# EAGLE design p128relay (EAGLE 9.6.2)
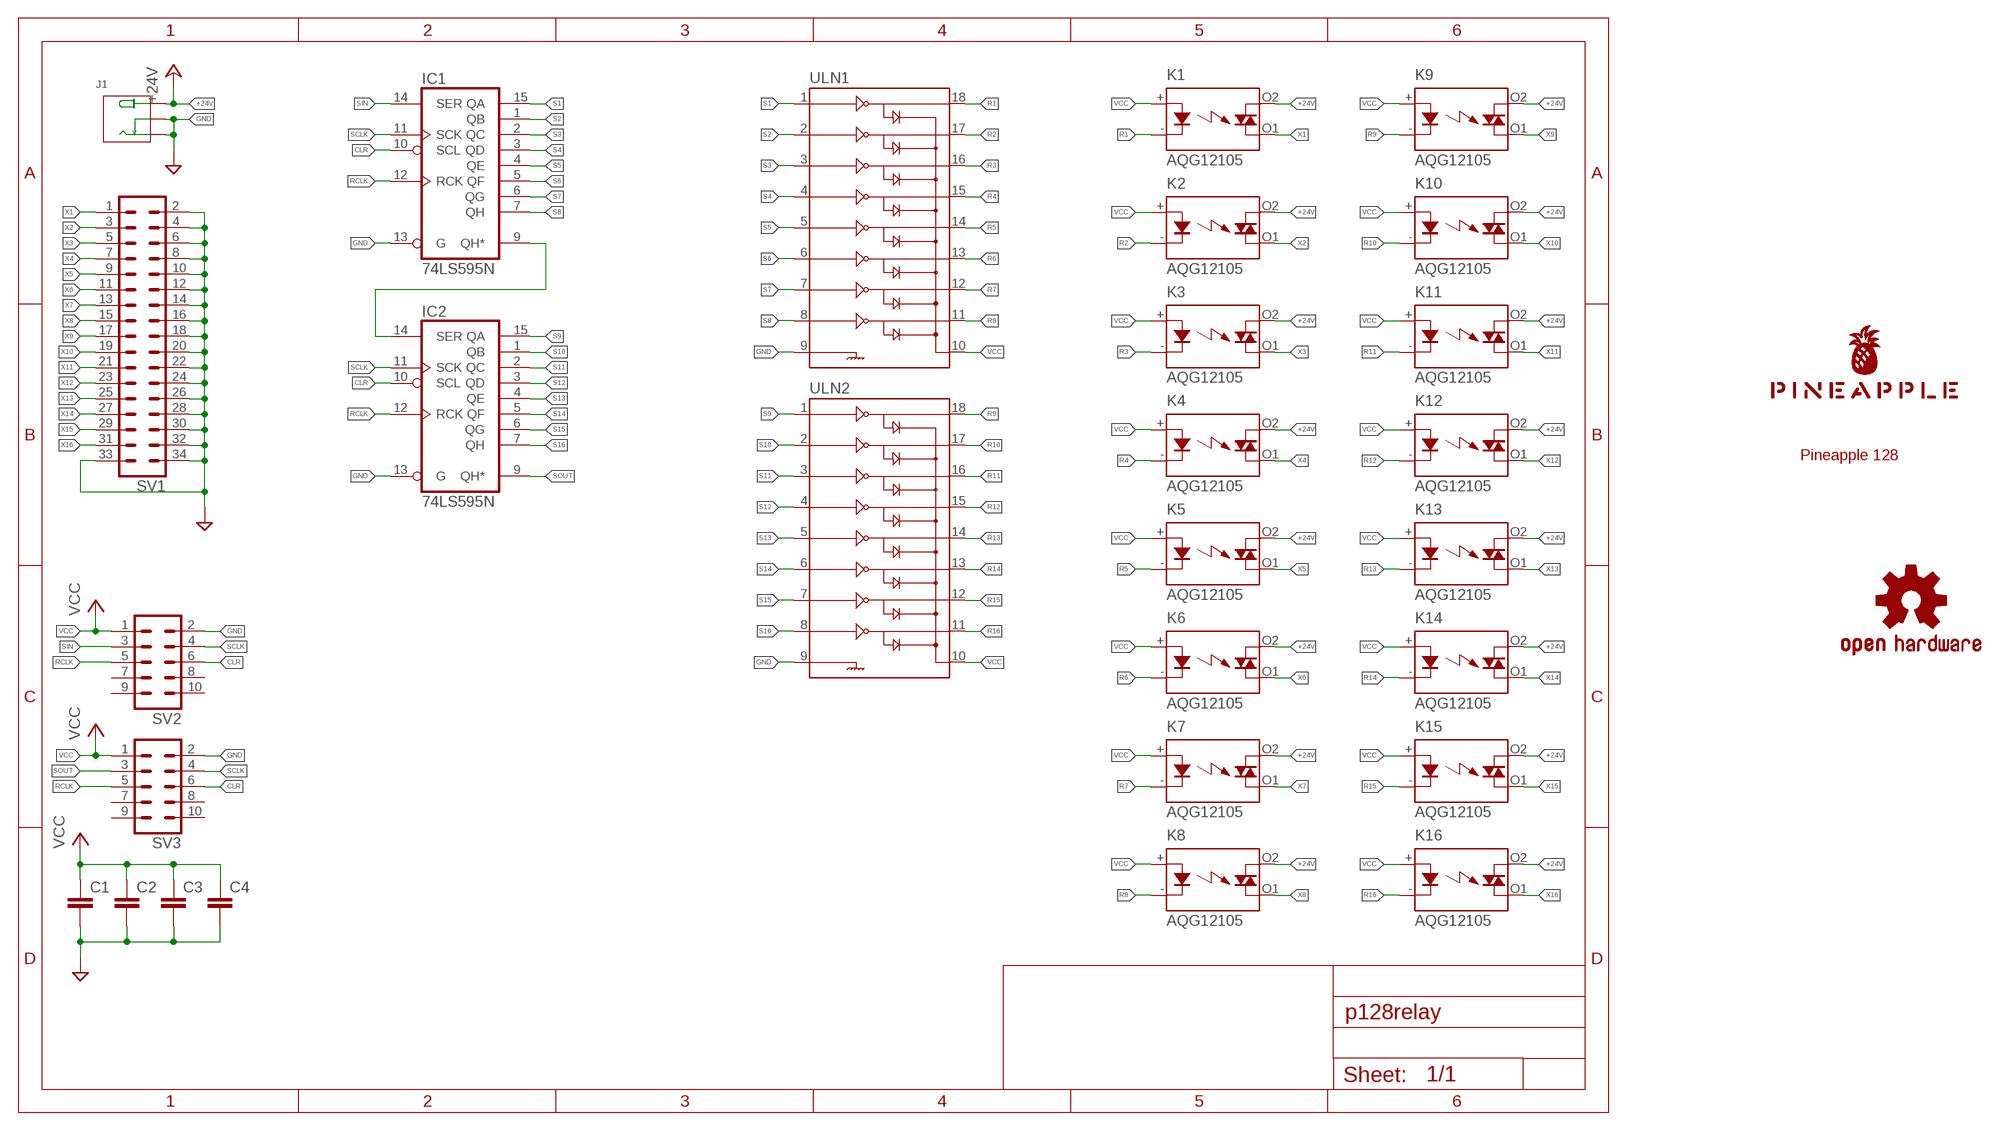
[diagram p0: schematic, sheet 1]

## Parts
C1  C-EU025-024X044  [C025-024X044]
C2  C-EU025-024X044  [C025-024X044]
C3  C-EU025-024X044  [C025-024X044]
C4  C-EU025-024X044  [C025-024X044]
IC1  74LS595N  [DIL16]
IC2  74LS595N  [DIL16]
J1  JACK-DC-005'DC-005'  [3P-L14.2*W11.0*H9.0MM]
K1  AQG12105  [AQG]
K2  AQG12105  [AQG]
K3  AQG12105  [AQG]
K4  AQG12105  [AQG]
K5  AQG12105  [AQG]
K6  AQG12105  [AQG]
K7  AQG12105  [AQG]
K8  AQG12105  [AQG]
K9  AQG12105  [AQG]
K10  AQG12105  [AQG]
K11  AQG12105  [AQG]
K12  AQG12105  [AQG]
K13  AQG12105  [AQG]
K14  AQG12105  [AQG]
K15  AQG12105  [AQG]
K16  AQG12105  [AQG]
LOGO1  OSHW-LOGOS-COPPER  [OSHW-LOGO-S_COPPER]
SV1  ML34L  [ML34L]
SV2  ML10L  [ML10L]
SV3  ML10L  [ML10L]
U$1  PINEAPPLE450_SILK  [PINEAPPLE450_SILK]
ULN1  ULN2803DIP  [DIL18]
ULN2  ULN2803DIP  [DIL18]

## Nets
+24V [power]: J1.+ K1.O2(DS1) K2.O2(DS1) K3.O2(DS1) K4.O2(DS1) K5.O2(DS1) K6.O2(DS1) K7.O2(DS1) K8.O2(DS1) K9.O2(DS1) K10.O2(DS1) K11.O2(DS1) K12.O2(DS1) K13.O2(DS1) K14.O2(DS1) K15.O2(DS1) K16.O2(DS1)
CLR: IC1.10(SCL) IC2.10(SCL) SV2.6 SV3.6
GND [gnd]: C1.2 C2.2 C3.2 C4.2 IC1.13(G) IC2.13(G) J1.-1(-) J1.-2(CDN) SV1.2 SV1.4 SV1.6 SV1.8 SV1.10 SV1.12 SV1.14 SV1.16 SV1.18 SV1.20 SV1.22 SV1.24 SV1.26 SV1.28 SV1.30 SV1.32 SV1.33 SV1.34 SV2.2 SV3.2 ULN1.9 ULN2.9
N$9: IC1.9(QH*) IC2.14(SER)
R1: K1.-(K) ULN1.18
R2: K2.-(K) ULN1.17
R3: K3.-(K) ULN1.16
R4: K4.-(K) ULN1.15
R5: K5.-(K) ULN1.14
R6: K6.-(K) ULN1.13
R7: K7.-(K) ULN1.12
R8: K8.-(K) ULN1.11
R9: K9.-(K) ULN2.18
R10: K10.-(K) ULN2.17
R11: K11.-(K) ULN2.16
R12: K12.-(K) ULN2.15
R13: K13.-(K) ULN2.14
R14: K14.-(K) ULN2.13
R15: K15.-(K) ULN2.12
R16: K16.-(K) ULN2.11
RCLK: IC1.12(RCK) IC2.12(RCK) SV2.5 SV3.5
S1: IC1.15(QA) ULN1.1
S2: IC1.1(QB) ULN1.2
S3: IC1.2(QC) ULN1.3
S4: IC1.3(QD) ULN1.4
S5: IC1.4(QE) ULN1.5
S6: IC1.5(QF) ULN1.6
S7: IC1.6(QG) ULN1.7
S8: IC1.7(QH) ULN1.8
S9: IC2.15(QA) ULN2.1
S10: IC2.1(QB) ULN2.2
S11: IC2.2(QC) ULN2.3
S12: IC2.3(QD) ULN2.4
S13: IC2.4(QE) ULN2.5
S14: IC2.5(QF) ULN2.6
S15: IC2.6(QG) ULN2.7
S16: IC2.7(QH) ULN2.8
SCLK: IC1.11(SCK) IC2.11(SCK) SV2.4 SV3.4
SIN: IC1.14(SER) SV2.3
SOUT: IC2.9(QH*) SV3.3
VCC: C1.1 C2.1 C3.1 C4.1 K1.+(A) K2.+(A) K3.+(A) K4.+(A) K5.+(A) K6.+(A) K7.+(A) K8.+(A) K9.+(A) K10.+(A) K11.+(A) K12.+(A) K13.+(A) K14.+(A) K15.+(A) K16.+(A) SV2.1 SV3.1 ULN1.10 ULN2.10
X1: K1.O1(DS2) SV1.1
X2: K2.O1(DS2) SV1.3
X3: K3.O1(DS2) SV1.5
X4: K4.O1(DS2) SV1.7
X5: K5.O1(DS2) SV1.9
X6: K6.O1(DS2) SV1.11
X7: K7.O1(DS2) SV1.13
X8: K8.O1(DS2) SV1.15
X9: K9.O1(DS2) SV1.17
X10: K10.O1(DS2) SV1.19
X11: K11.O1(DS2) SV1.21
X12: K12.O1(DS2) SV1.23
X13: K13.O1(DS2) SV1.25
X14: K14.O1(DS2) SV1.27
X15: K15.O1(DS2) SV1.29
X16: K16.O1(DS2) SV1.31
Unconnected: SV2.7 SV2.8 SV2.9 SV2.10 SV3.7 SV3.8 SV3.9 SV3.10

## Notes on the sheet
- Pineapple 128

## Power pins joined to a net without a drawn wire
GND: IC1.8(GND) IC2.8(GND)
VCC: IC1.16(VCC) IC2.16(VCC)

## Library data of the parts
C1-C4 = resistor:C-EU: CAPACITOR, European symbol
IC1 IC2 = 74xx-us:74*595: 8-bit SHIFT REGISTER, output latch
J1 = Seeed-Connector:JACK-DC-005: 320120003
K1-K16 = relay:AQG*: SOLID STATE RELAY NAiS Zero-cross, Non zero-cross Source: http://www.mew-europe.com/.. en_ds_61611_0000.pdf; MF: AROMAT/ MATSUSHITA; MPN: AQG12105; OC_FARNELL: unknown; OC_NEWARK: 20J4759
LOGO1 = SparkFun-Aesthetics:OSHW-LOGO: Open-Source Hardware (OSHW) Logo This logo indicates the piece of hardware it is found on incorporates a OSHW license and/or adheres to the definition of open source hardware found here: http://freedomdefined.org/OSHW
SV1 = con-ml:ML34L: HARTING; OC_FARNELL: unknown; OC_NEWARK: unknown
SV2 SV3 = con-ml:ML10L: HARTING; OC_FARNELL: unknown; OC_NEWARK: unknown
U$1 = pineapple:PINEAPPLE450_SILK
ULN1 ULN2 = SparkFun-IC-Special-Function:ULN2803: Darlington Driver(IC-07959, low stock) ULN2803 Darlington array. 500mA max per channel, 8-channel package. Spark Fun Electronics SKU : COM-00312

## Net classes
0 default: width 0.152 mm, drill 0.152 mm, clearance 0.152 mm
1 gnd: width 0.61 mm, drill 0.152 mm, clearance 0.152 mm
2 power: width 0.61 mm, drill 0.152 mm, clearance 0.152 mm
3 analog: width 0.305 mm, drill 0.152 mm, clearance 0.152 mm

## Board
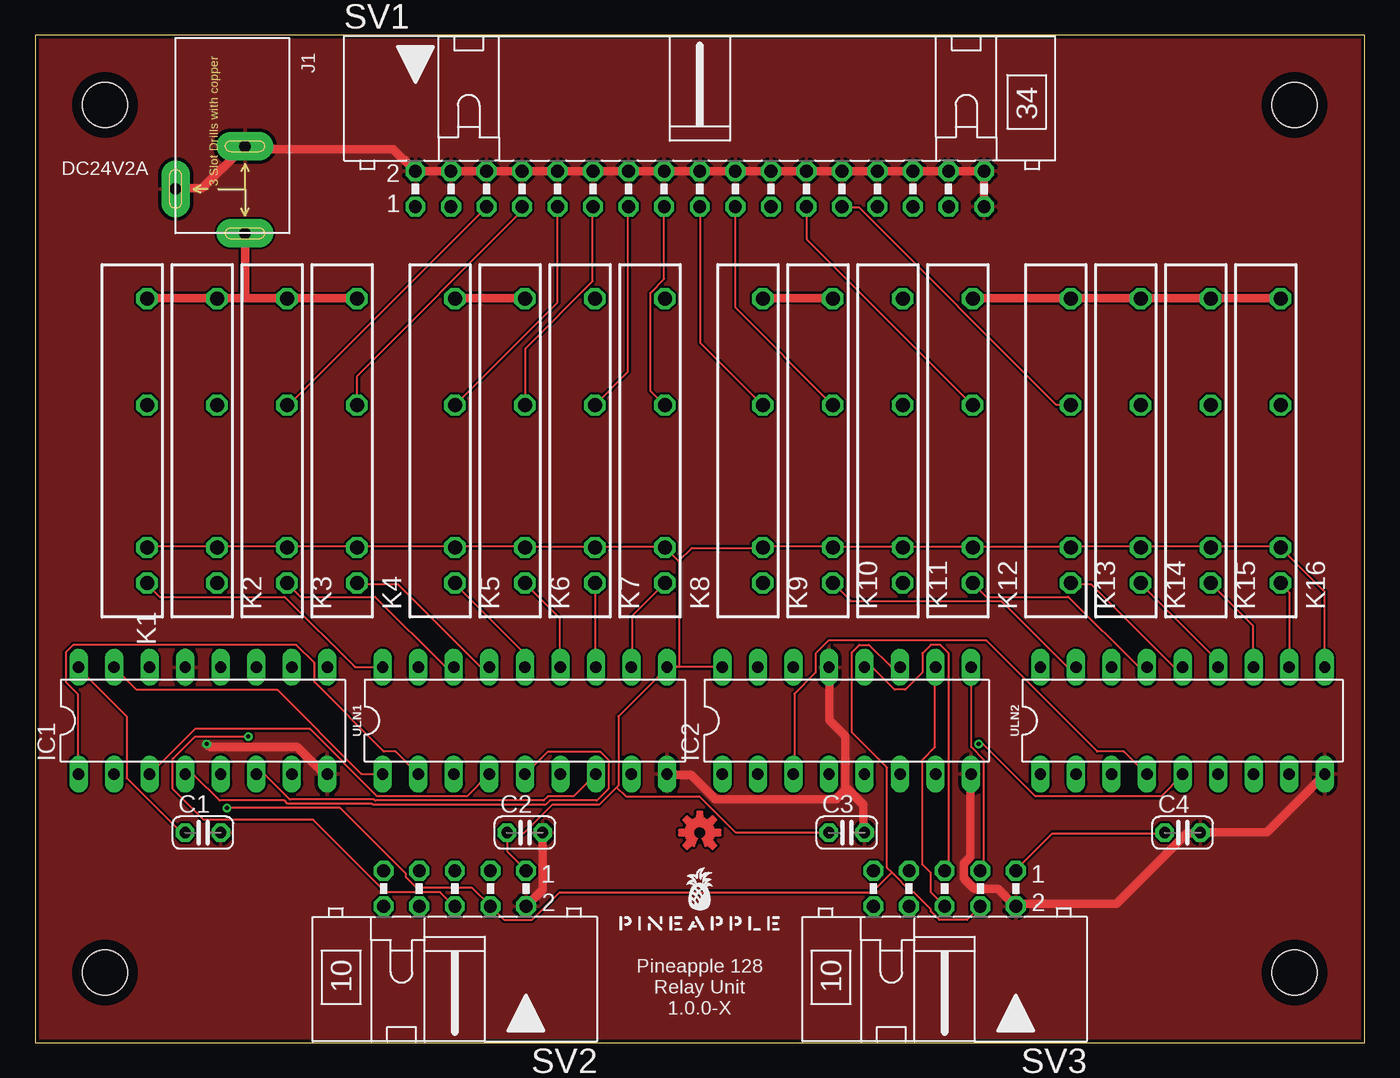
[diagram p1: board, top side]
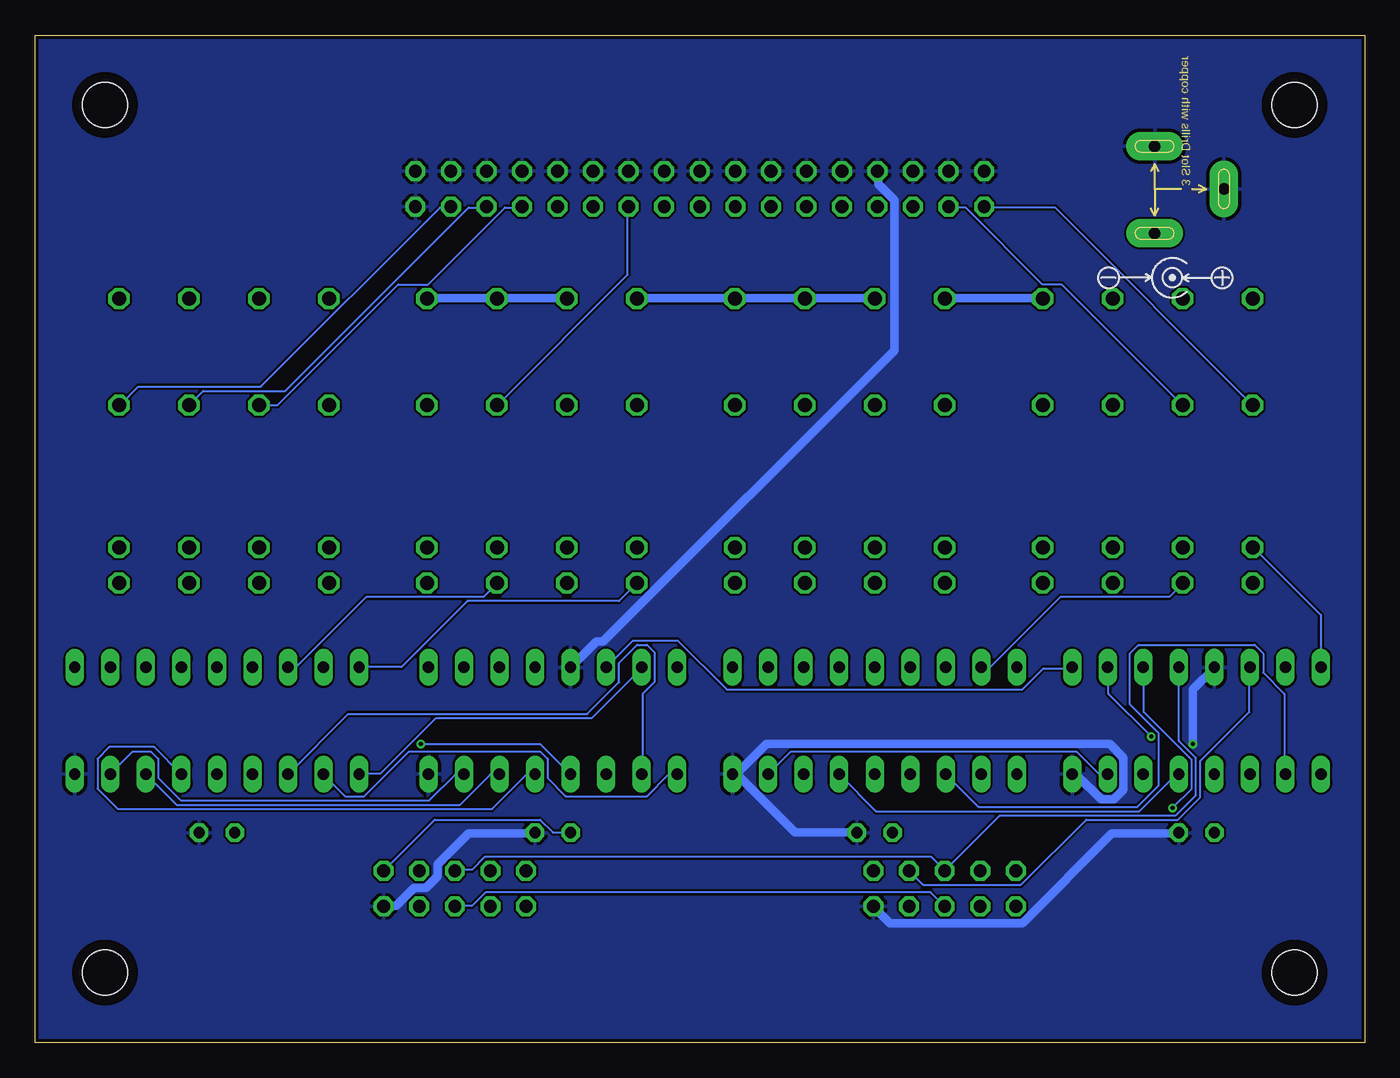
[diagram p2: board, bottom side, seen from below]

Size 95 x 72 mm. Coordinates in mm from the lower left corner, seen from the top.
Outline: 0,0 95,0 95,72 0,72 0,0
Copper layers (1*16): Top 0.035mm / dielectric 1.5mm / Bottom 0.035mm
Design rules "SeeedStudio_2layer_DRU_no_angle_20140221": minimum track width 6mil, minimum drill 12mil, track to track 6mil, track to pad 6mil, pad to pad 6mil, via to via 6mil, smd to smd 0mil, copper to edge 10mil, drill to drill 10mil, minimum pad ring 10mil, minimum via ring 6mil, stop-mask expansion 2mil, vias tented up to drill 100mil, thermal gap 10mil
Holes 3.2 mm at 5,5 90,5 90,67 5,67
tRestrict: area 2.8,64.8 to 7.2,69.2; area 87.8,64.8 to 92.2,69.2; area 2.8,2.8 to 7.2,7.2; area 87.8,2.8 to 92.2,7.2
bRestrict: area 2.8,2.8 to 7.2,7.2; area 87.8,2.8 to 92.2,7.2; area 87.8,64.8 to 92.2,69.2; area 2.8,64.8 to 7.2,69.2

### Footprints (pad centres in the part's own frame; a part is rotated, then mirrored left to right if it is on the bottom)
C025-024X044 = drill 0.813 octagon: 1 -1.27,0; 2 1.27,0
DIL16 = drill 0.813 long: 1 -8.89,-3.81; 2 -6.35,-3.81; 3 -3.81,-3.81; 4 -1.27,-3.81; 5 1.27,-3.81; 6 3.81,-3.81; 7 6.35,-3.81; 8 8.89,-3.81; 9 8.89,3.81; 10 6.35,3.81; 11 3.81,3.81; 12 1.27,3.81; 13 -1.27,3.81; 14 -3.81,3.81; 15 -6.35,3.81; 16 -8.89,3.81
3P-L14.2*W11.0*H9.0MM = drill 0.813 pad 2.032 long: + 3.175,0; -1 -3.048,0; -2 0,-4.953
AQG = drill 1 octagon: + -7.62,0; - -10.16,0; O1 2.54,0; O2 10.16,0
ML34L = drill 0.914 octagon: 1 -20.32,-1.27; 2 -20.32,1.27; 3 -17.78,-1.27; 4 -17.78,1.27; 5 -15.24,-1.27; 6 -15.24,1.27; 7 -12.7,-1.27; 8 -12.7,1.27; 9 -10.16,-1.27; 10 -10.16,1.27; 11 -7.62,-1.27; 12 -7.62,1.27; 13 -5.08,-1.27; 14 -5.08,1.27; 15 -2.54,-1.27; 16 -2.54,1.27; 17 0,-1.27; 18 0,1.27; 19 2.54,-1.27; 20 2.54,1.27; 21 5.08,-1.27; 22 5.08,1.27; 23 7.62,-1.27; 24 7.62,1.27; 25 10.16,-1.27; 26 10.16,1.27; 27 12.7,-1.27; 28 12.7,1.27; 29 15.24,-1.27; 30 15.24,1.27; 31 17.78,-1.27; 32 17.78,1.27; 33 20.32,-1.27; 34 20.32,1.27
ML10L = drill 0.914 octagon: 1 -5.08,-1.27; 2 -5.08,1.27; 3 -2.54,-1.27; 4 -2.54,1.27; 5 0,-1.27; 6 0,1.27; 7 2.54,-1.27; 8 2.54,1.27; 9 5.08,-1.27; 10 5.08,1.27
DIL18 = drill 0.813 long: 1 -10.16,-3.81; 2 -7.62,-3.81; 3 -5.08,-3.81; 4 -2.54,-3.81; 5 0,-3.81; 6 2.54,-3.81; 7 5.08,-3.81; 8 7.62,-3.81; 9 10.16,-3.81; 10 10.16,3.81; 11 7.62,3.81; 12 5.08,3.81; 13 2.54,3.81; 14 0,3.81; 15 -2.54,3.81; 16 -5.08,3.81; 17 -7.62,3.81; 18 -10.16,3.81

### Placement (x,y rotation side)
C1  12,15 0 top
C2  35,15 0 top
C3  58,15 0 top
C4  82,15 0 top
IC1  12,23 0 top
IC2  58,23 0 top
J1  15,61 270 top
K1  8,43 90 top
K2  13,43 90 top
K3  18,43 90 top
K4  23,43 90 top
K5  30,43 90 top
K6  35,43 90 top
K7  40,43 90 top
K8  45,43 90 top
K9  52,43 90 top
K10  57,43 90 top
K11  62,43 90 top
K12  67,43 90 top
K13  74,43 90 top
K14  79,43 90 top
K15  84,43 90 top
K16  89,43 90 top
LOGO1  47.5,15 0 top
SV1  47.5,61 0 top
SV2  30,11 180 top
SV3  65,11 180 top
U$1  47.5,8 0 top
ULN1  35,23 0 top
ULN2  82,23 0 top

### Tracks (layer width: path | path; a pad name or v marks a point on that pad's centre or on a via)
+24V
  Top 0.61: K1.O2 8,53.19 12.95,53.19 K2.O2 13.26,53.19 15.01,53.19 | 15.01,53.19 17.98,53.19 K3.O2 18.29,53.19 22.94,53.19 K4.O2 | 15.01,53.19 15.01,57.76 J1.+ | K16.O2 88.92,53.19 84.28,53.19 K15.O2 83.97,53.19 79.25,53.19 K14.O2 78.94,53.19 74.07,53.19 K13.O2 73.69,53.19 67.06,53.19 K12.O2 | K5.O2 30.02,53.19 34.98,53.19 K6.O2 | K9.O2 52.05,53.19 57,53.19 K10.O2
  Bottom 0.61: K6.O2 35.05,53.19 39.93,53.19 K7.O2 40.31,53.19 44.96,53.19 K8.O2 45.26,53.19 51.97,53.19 K9.O2 | K10.O2 57.07,53.19 61.95,53.19 K11.O2 62.26,53.19 66.98,53.19 K12.O2 | K4.O2 23.01,53.19 29.95,53.19 K5.O2
CLR  (via drill 0.3)
  Top 0.152: IC2.10 64.31,26.75 64.31,21.11 63.4,20.19 63.4,12.72 64.01,12.12 64.01,10.74 65,9.75 SV3.6 | v15.24,21.87 11.43,21.87 9.83,20.27 9.83,18.14 12.04,15.93 19.89,15.93 25.07,10.74 28.96,10.74 29.95,9.75 SV2.6
  Bottom 0.152: v15.24,21.87 18.29,24.92 18.29,26.75 IC1.10 | SV3.6 65,9.75 63.78,9.75 62.79,10.74 31.01,10.74 30.02,9.75 SV2.6
GND  (via drill 0.3)
  Top 0.61: J1.-2 10.06,61.04 11.96,61.04 14.94,64.01 J1.-1 15.24,63.86 25.6,63.86 26.98,62.48 SV1.2 27.2,62.26 29.72,62.26 SV1.4 30.02,62.26 32.23,62.26 SV1.6 32.54,62.26 34.75,62.26 SV1.8 35.05,62.26 37.34,62.26 SV1.10 37.64,62.26 39.85,62.26 SV1.12 40.16,62.26 42.37,62.26 SV1.14 42.67,62.26 44.96,62.26 SV1.16 45.26,62.26 47.47,62.26 SV1.18 47.78,62.26 49.99,62.26 SV1.20 50.29,62.26 52.58,62.26 SV1.22 52.88,62.26 55.09,62.26 SV1.24 55.4,62.26 57.61,62.26 SV1.26 57.91,62.26 60.2,62.26 SV1.28 60.5,62.26 62.71,62.26 SV1.30 63.02,62.26 65.23,62.26 SV1.32 65.53,62.26 67.51,62.26 SV1.34 67.82,62.26 SV1.33 | v12.27,21.34 12.5,21.11 18.75,21.11 20.65,19.2 20.88,19.2 IC1.8 | C2.2 36.27,14.94 36.27,10.9 35.13,9.75 SV2.2 | ULN2.9 92.13,19.13 88.01,15.01 83.29,15.01 C4.2 82.98,14.94 82.3,14.94 77.27,9.91 70.33,9.91 SV3.2 70.03,9.75 68.81,10.97 67.13,10.97 66.37,11.73 66.37,12.8 66.83,13.26 66.83,19.13 IC2.8 | 58.03,18.17 57.91,18.29 57.91,21.87 56.77,23.01 56.77,26.75 IC2.13 | 58.03,18.17 59.21,16.99 59.21,15.01 C3.2 | 58.03,18.17 57.23,17.37 48.62,17.37 46.86,19.13 45.19,19.13 ULN1.9
  Bottom 0.61: v12.27,21.34 12.27,25.22 10.74,26.75 IC1.13 | C1.2 13.34,14.94 18.06,14.94 24.46,8.53 33.91,8.53 35.05,9.68 SV2.2 | C2.2 40.69,15.01 44.81,19.13 45.11,19.13 ULN1.9 44.73,19.36 42.75,21.34 18.21,21.34 17.22,20.34 17.22,18.06 17.91,17.37 18.82,17.37 20.57,19.13 20.88,19.13 IC1.8 | SV3.2 70.03,9.75 69.19,9.75 67.89,11.05 67.06,11.05 66.22,11.89 66.22,12.72 64.01,14.94 59.28,14.94 C3.2 | SV1.8 34.75,62.26 34.75,61.34 33.6,60.2 33.6,49.45 54.41,28.65 54.86,28.65 56.69,26.82 IC2.13
  pour Top: -1,-1 96,-1 96,73 -1,73
  pour Bottom: -2,-2 97,-2 97,74 -2,74
N$9
  Bottom 0.152: IC1.9 20.95,26.75 22.94,26.75 24.46,25.22 45.57,25.22 49.07,28.73 52.27,28.73 54.18,26.82 IC2.14
R1
  Top 0.152: ULN1.18 24.77,26.82 22.86,26.82 17.83,31.85 8.91,31.85 8,32.77 K1.-
R2
  Bottom 0.152: ULN1.17 27.36,26.82 26.75,26.82 21.72,31.85 13.95,31.85 13.03,32.77 K2.-
R3
  Top 0.152: ULN1.16 29.87,26.82 29.34,26.82 24.31,31.85 18.97,31.85 18.06,32.77 K3.-
R4
  Top 0.152: ULN1.15 32.38,26.82 31.85,26.82 25.91,32.77 23.01,32.77 K4.-
R5
  Top 0.152: ULN1.14 34.98,26.82 34.98,27.81 30.02,32.77 K5.-
R6
  Top 0.152: ULN1.13 37.49,26.82 37.49,30.33 35.05,32.77 K6.-
R7
  Top 0.152: ULN1.12 40.01,26.82 40.01,32.77 K7.-
R8
  Top 0.152: ULN1.11 42.67,26.82 42.67,30.48 44.96,32.77 K8.-
R9
  Bottom 0.152: ULN2.18 71.78,26.82 68.81,26.82 64.08,31.55 53.26,31.55 52.05,32.77 K9.-
R10
  Top 0.152: ULN2.17 74.37,26.82 73.76,26.82 69.04,31.55 58.29,31.55 57.07,32.77 K10.-
R11
  Bottom 0.152: ULN2.16 76.89,26.82 76.35,26.82 71.32,31.85 62.94,31.85 62.03,32.77 K11.-
R12
  Top 0.152: ULN2.15 79.4,26.82 78.87,26.82 73.84,31.85 67.97,31.85 67.06,32.77 K12.-
R13
  Top 0.152: ULN2.14 81.99,26.82 81.38,26.82 75.44,32.77 74.07,32.77 K13.-
R14
  Top 0.152: ULN2.13 84.51,26.82 84.51,27.28 79.02,32.77 K14.-
R15
  Top 0.152: ULN2.12 87.02,26.82 87.02,29.79 84.05,32.77 K15.-
R16
  Top 0.152: ULN2.11 89.61,26.82 89.61,32.16 89,32.77 K16.-
RCLK
  Top 0.152: IC2.12 59.28,26.75 59.89,26.75 61.42,25.22 62.18,25.22 63.4,26.44 63.4,27.81 64.01,28.42 64.69,28.42 65.3,27.81 65.3,12.57 65.08,12.34 SV3.5
  Bottom 0.152: IC1.12 13.26,26.75 13.26,21.57 12.04,20.34 12.04,17.68 13.49,16.23 26.06,16.23 29.95,12.34 SV2.5 30.02,12.34 30.94,13.26 62.87,13.26 63.78,12.34 65,12.34 SV3.5
S1
  Top 0.152: ULN1.1 24.77,19.2 23.32,19.2 17.3,25.22 7.24,25.22 5.71,26.75 IC1.15
S2
  Top 0.152: IC1.1 3.05,19.2 3.05,24.92 2.21,25.76 2.21,27.89 2.74,28.42 18.67,28.42 19.96,27.13 19.96,25.76 24.92,20.8 25.76,20.8 27.36,19.2 ULN1.2
S3
  Bottom 0.152: IC1.2 5.71,19.2 5.71,24.92 7.24,26.44 7.24,27.81 7.85,28.42 16.15,28.42 16.76,27.81 16.76,24.16 14.71,22.1 14.71,18.36 16.23,16.84 27.58,16.84 29.87,19.13 ULN1.3
S4
  Top 0.152: IC1.3 8.23,19.2 11.43,22.4 19.66,22.4 24.46,17.6 30.86,17.6 32.38,19.13 ULN1.4
S5
  Top 0.152: IC1.4 10.74,19.13 11.35,19.13 13.18,17.3 17.83,17.3 18.06,17.07 24.08,17.07 24.16,16.99 36.5,16.99 36.8,17.3 40.16,17.3 41,18.14 41,20.19 40.39,20.8 36.65,20.8 35.05,19.2 ULN1.5
S6
  Bottom 0.152: IC1.5 13.34,19.13 13.49,19.13 16.08,16.54 34.9,16.54 37.49,19.13 ULN1.6
S7
  Top 0.152: IC1.6 15.85,19.13 16.46,19.13 18.21,17.37 24.23,17.37 24.31,17.3 36.35,17.3 36.65,17.6 38.48,17.6 40.01,19.13 ULN1.7
S8
  Bottom 0.152: IC1.7 18.36,19.2 18.97,19.2 20.57,20.8 41,20.8 42.6,19.2 ULN1.8
S9
  Bottom 0.152: ULN2.1 71.78,19.2 70.33,19.2 66.37,23.16 55.24,23.16 51.66,26.75 IC2.15
S10
  Bottom 0.152: IC2.1 49.15,19.13 49.76,19.13 51.28,17.6 57.07,17.6 58.37,18.9 58.37,20.27 58.9,20.8 68.28,20.8 71.48,17.6 72.85,17.6 74.37,19.13 ULN2.2
S11
  Bottom 0.152: IC2.2 51.59,19.2 51.59,24.92 50.75,25.76 50.75,27.89 51.28,28.42 51.97,28.42 53.26,27.13 53.26,25.76 55.55,23.47 72.62,23.47 76.89,19.2 ULN2.3
S12
  Top 0.152: IC2.3 54.25,19.2 54.25,24.92 55.78,26.44 55.78,27.81 56.69,28.73 67.97,28.73 75.89,20.8 77.8,20.8 79.4,19.2 ULN2.4
S13  (via drill 0.3)
  Top 0.152: v67.44,21.34 67.74,21.34 71.48,17.6 80.47,17.6 81.99,19.13 ULN2.5
  Bottom 0.152: v67.44,21.34 58.9,21.34 56.77,19.2 IC2.4
S14
  Bottom 0.152: IC2.5 59.28,19.13 59.89,19.13 62.33,16.69 89.08,16.69 90.53,18.14 90.53,20.27 89.69,21.11 86.49,21.11 84.58,19.2 ULN2.6
S15
  Bottom 0.152: IC2.6 61.87,19.13 62.48,19.13 64.62,16.99 84.89,16.99 87.02,19.13 ULN2.7
S16
  Bottom 0.152: IC2.7 64.39,19.13 65,19.13 66.83,17.3 84.58,17.3 86.18,18.9 86.18,20.27 86.72,20.8 88.01,20.8 89.61,19.2 ULN2.8
SCLK  (via drill 0.3)
  Top 0.152: 61.23,12.15 62.64,10.74 62.79,10.74 64.01,9.53 64.01,9.37 64.62,8.76 66.6,8.76 67.51,9.68 SV3.4 | 61.23,12.15 60.88,12.5 60.88,19.66 58.37,22.17 58.37,27.89 58.9,28.42 59.59,28.42 61.19,26.82 61.8,26.82 IC2.11 | v13.72,16.76 21.79,16.76 26.52,12.04 26.52,11.81 27.28,11.05 31.24,11.05 32.54,9.75 SV2.4 32.61,9.68 33.53,8.76 35.51,8.76 37.49,10.74 59.82,10.74 61.23,12.15
  Bottom 0.152: v13.72,16.76 12.34,18.14 12.34,20.19 15.77,23.62 15.77,26.75 IC1.11
SIN
  Bottom 0.152: IC1.14 8.23,26.75 8.23,23.62 11.73,20.12 11.73,17.53 13.34,15.93 19.89,15.93 24.54,11.28 31.55,11.28 SV2.3
SOUT
  Top 0.152: IC2.9 66.9,26.75 66.9,21.11 67.82,20.19 67.82,12.57 67.59,12.34 SV3.3
VCC
  Top 0.152: ULN2.10 92.13,26.82 92.13,32.23 89,35.36 K16.+ 88.92,35.43 84.05,35.43 K15.+ 83.97,35.43 79.02,35.43 K14.+ 78.94,35.43 74.07,35.43 K13.+ 73.99,35.43 67.06,35.43 K12.+ 66.98,35.43 62.03,35.43 K11.+ 61.95,35.43 57.07,35.43 K10.+ 57,35.43 52.05,35.43 K9.+ 51.97,35.36 46.94,35.36 45.99,34.4 | C4.1 80.7,14.94 72.69,14.94 70.1,12.34 SV3.1 | C1.1 10.67,15.01 10.44,15.01 6.55,18.9 6.55,23.32 3.12,26.75 IC1.16 | K1.+ 8,35.43 12.95,35.43 K2.+ 13.03,35.43 17.98,35.43 K3.+ 18.06,35.43 22.94,35.43 K4.+ 23.01,35.43 29.95,35.43 K5.+ 30.02,35.43 34.98,35.43 K6.+ 35.05,35.43 39.93,35.43 K7.+ 40.01,35.43 44.96,35.43 K8.+ 45.03,35.36 45.99,34.4 | SV2.1 35.05,12.34 33.76,13.64 33.76,14.94 C2.1 33.83,14.94 34.9,14.94 36.96,16.99 40.31,16.99 41.57,18.25 | 46.02,26.82 49.07,26.82 IC2.16 | 46.02,26.82 45.19,26.82 ULN1.10 45.11,26.75 41.68,23.32 41.68,18.36 41.57,18.25 | 46.02,26.82 46.02,34.37 45.99,34.4 | 41.57,18.25 42.22,17.6 47.47,17.6 50.06,15.01 56.69,15.01 C3.1
  Bottom 0.152: C3.1 56.77,15.01 57.99,15.01 58.9,15.93 66.45,15.93 70.03,12.34 SV3.1 | IC1.16 3.12,26.82 3.12,30.56 7.92,35.36 K1.+
X1
  Bottom 0.152: SV1.1 27.13,59.66 22.1,59.66 8,45.57 K1.O1
X2
  Bottom 0.152: SV1.3 29.72,59.66 28.5,59.66 23.01,54.18 21.64,54.18 13.03,45.57 K2.O1
X3
  Top 0.152: SV1.5 32.23,59.66 18.06,45.49 K3.O1
X4
  Top 0.152: SV1.7 34.75,59.66 34.75,59.36 23.01,47.62 23.01,45.57 K4.O1
X5
  Top 0.152: SV1.9 37.34,59.66 37.34,52.88 30.02,45.57 K5.O1
X6
  Top 0.152: SV1.11 39.85,59.66 39.85,54.41 35.05,49.61 35.05,45.57 K6.O1
X7
  Top 0.152: SV1.13 42.37,59.66 42.37,47.93 40.01,45.57 K7.O1
X8
  Top 0.152: SV1.15 44.96,59.66 44.96,54.56 43.97,53.57 43.97,46.56 44.96,45.57 K8.O1
X9
  Top 0.152: SV1.17 47.55,59.66 47.55,49.99 51.97,45.57 K9.O1
X10
  Top 0.152: SV1.19 50.06,59.66 50.06,52.5 57,45.57 K10.O1
X11
  Bottom 0.152: SV1.21 52.65,59.66 52.65,54.86 61.95,45.57 K11.O1
X12
  Top 0.152: SV1.23 55.17,59.66 55.17,57.38 66.98,45.57 K12.O1
X13
  Top 0.152: SV1.25 57.68,59.66 58.9,59.66 73,45.57 73.99,45.57 K13.O1
X14
  Bottom 0.152: SV1.27 60.27,59.66 61.42,59.66 66.9,54.18 69.04,54.18 77.65,45.57 78.94,45.57 K14.O1
X15
  Bottom 0.152: K15.O1 82.98,46.56 77.11,46.56 64.01,59.66 62.79,59.66 SV1.29
X16
  Bottom 0.152: SV1.31 65.3,59.66 66.06,59.66 78.87,46.86 87.63,46.86 88.92,45.57 K16.O1

### Text on the board
tNames: DC24V2A | Pineapple 128 / Relay Unit / 1.0.0-X